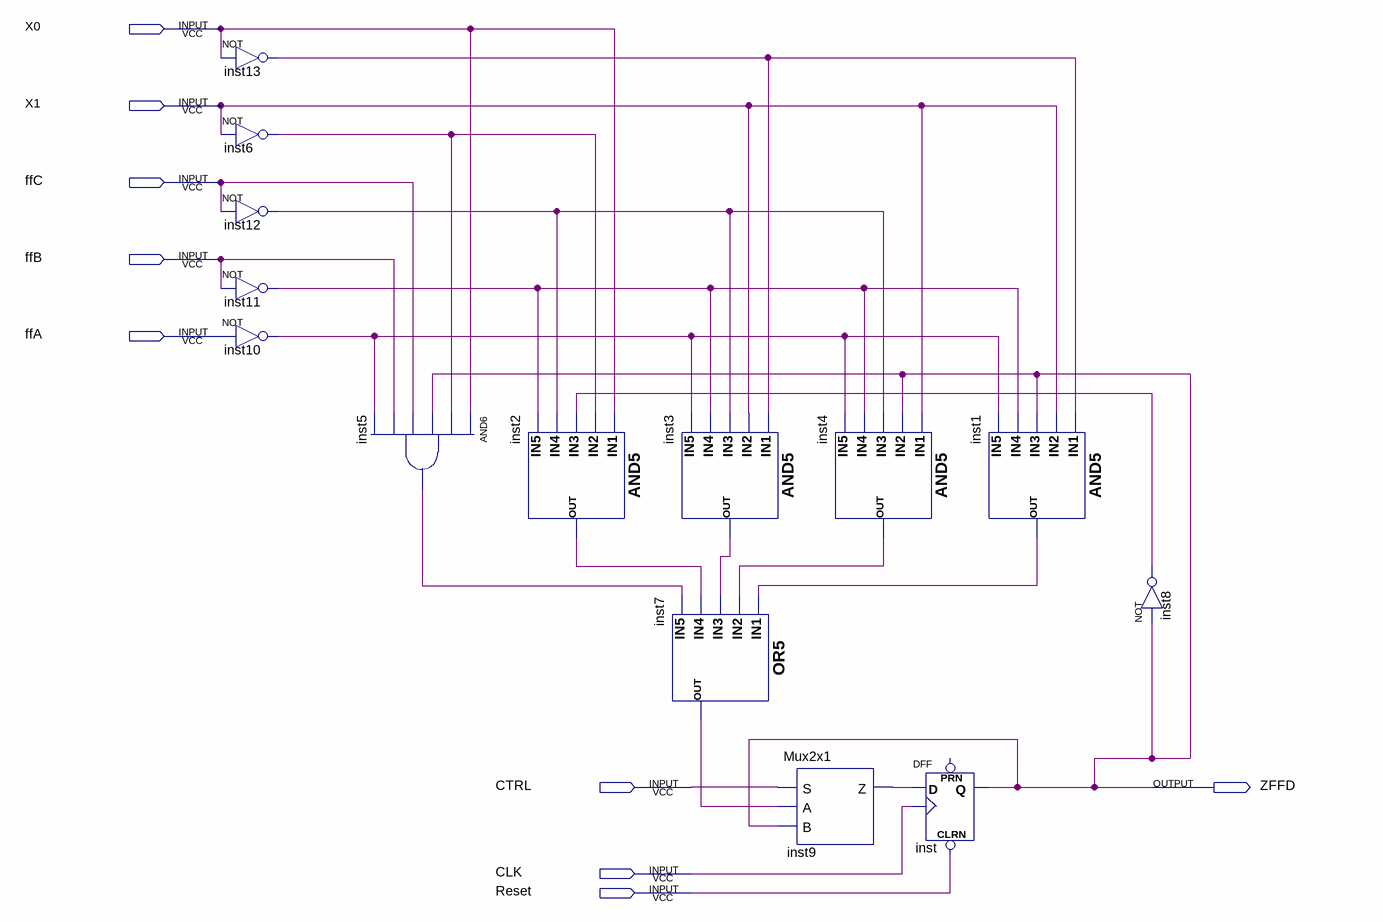
[diagram p0: schematic sheet]
// Quartus schematic EquacaoFFD.bdf as structural Verilog: 14 symbols, 9 pins
module EquacaoFFD (
  input  X0,
  input  X1,
  input  ffC,
  input  ffB,
  input  ffA,
  input  CTRL,
  input  CLK,
  input  Reset,
  output ZFFD
);

  wire inst1_out, inst2_out, inst3_out, inst4_out, inst5_out, inst6_out, inst7_out, inst8_out, inst9_z,
       inst10_out, inst11_out, inst12_out, inst13_out;

  not inst13 (inst13_out, X0);
  not inst6 (inst6_out, X1);
  not inst12 (inst12_out, ffC);
  not inst11 (inst11_out, ffB);
  not inst10 (inst10_out, ffA);
  and inst5 (inst5_out, X0, inst6_out, ZFFD, ffC, ffB, inst10_out);
  and inst2 (inst2_out, X0, inst6_out, inst8_out, inst12_out, inst11_out);
  and inst3 (inst3_out, inst13_out, X1, inst12_out, inst11_out, inst10_out);
  or inst7 (inst7_out, inst1_out, inst4_out, inst3_out, inst2_out, inst5_out);
  and inst4 (inst4_out, X1, ZFFD, inst12_out, inst11_out, inst10_out);
  Mux2x1 inst9 (.S(CTRL), .A(inst7_out), .B(ZFFD), .Z(inst9_z));
  and inst1 (inst1_out, inst13_out, X1, ZFFD, inst11_out, inst10_out);
  DFF inst (.CLRN(Reset), .CLK(CLK), .D(inst9_z), .Q(ZFFD));  // open: PRN
  not inst8 (inst8_out, ZFFD);
endmodule
